# EAGLE schematic Range Finder Schematic v16 (EAGLE 9.7.0)
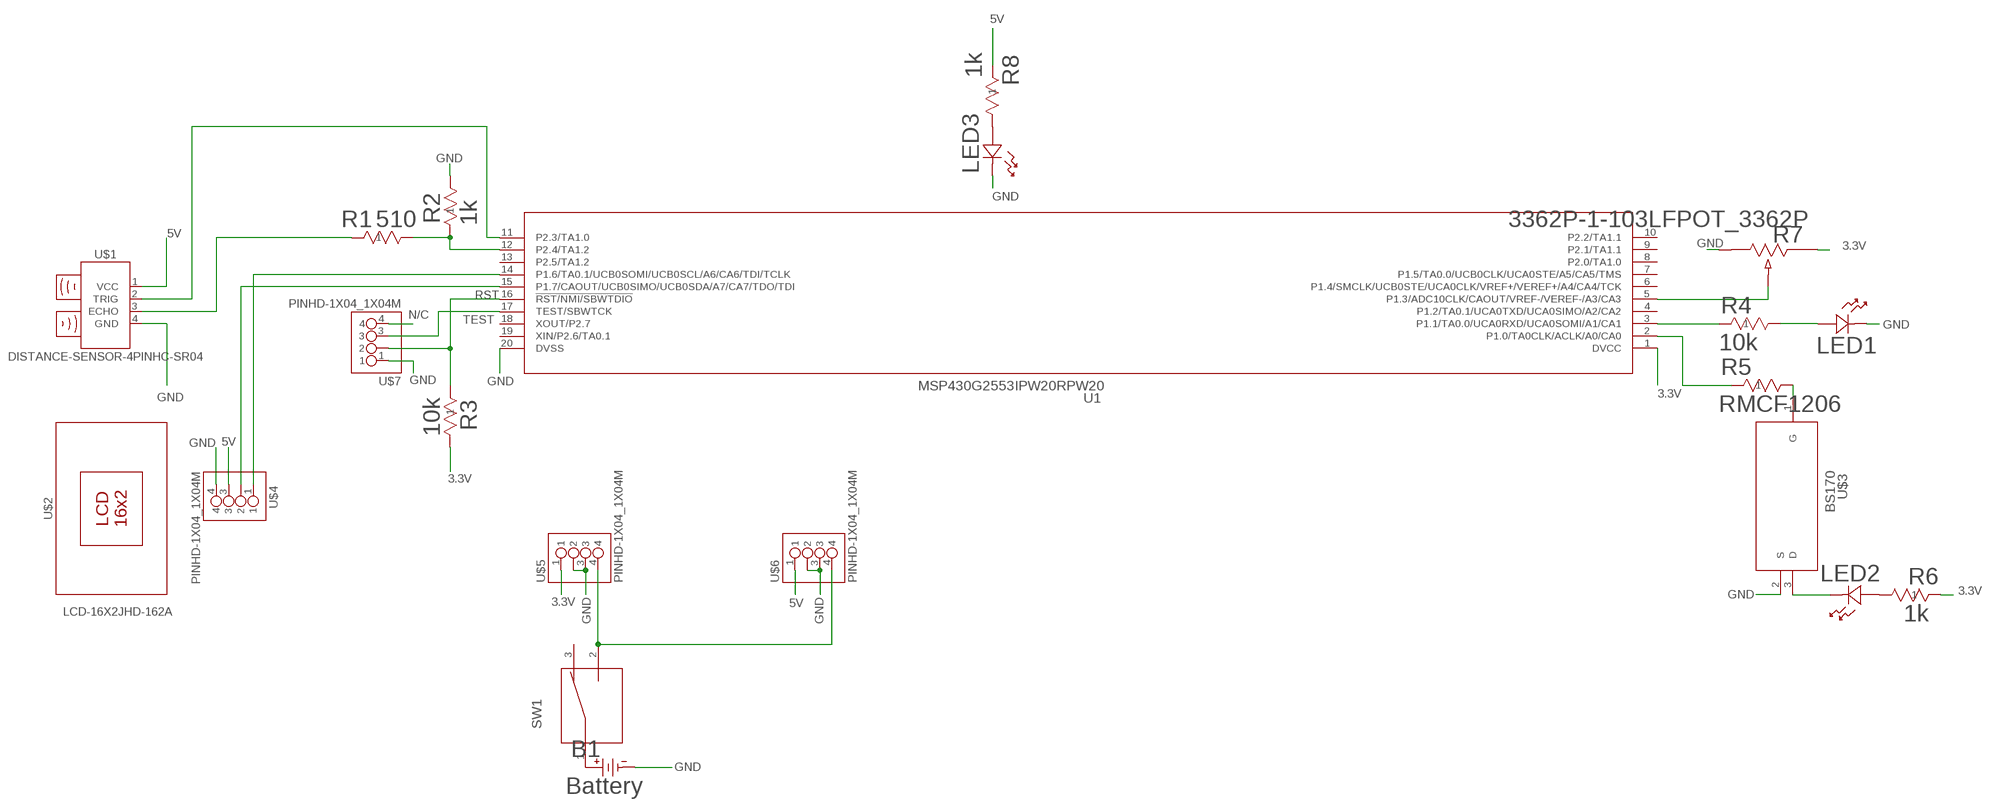
[diagram p0: schematic, sheet 1]

## Parts
B1  Battery  24622462_KEY  [2462_KEY]
LED1  150080BS75000LED_BS75000_WRE  [LED_BS75000_WRE]
LED2  150080BS75000LED_BS75000_WRE  [LED_BS75000_WRE]
LED3  150080BS75000LED_BS75000_WRE  [LED_BS75000_WRE]
R1  510  RMCF1206JT510RSTA_RMCF1206_STP  [STA_RMCF1206_STP]
R2  1k  RMCF1206JT510RSTA_RMCF1206_STP  [STA_RMCF1206_STP]
R3  10k  RMCF1206JT510RSTA_RMCF1206_STP  [STA_RMCF1206_STP]
R4  10k  RMCF1206JT510RSTA_RMCF1206_STP  [STA_RMCF1206_STP]
R5  RMCF1206  RMCF1206JT510RSTA_RMCF1206_STP  [STA_RMCF1206_STP]
R6  1k  RMCF1206JT510RSTA_RMCF1206_STP  [STA_RMCF1206_STP]
R7  3362P-1-103LFPOT_3362P  [POT_3362P]
R8  1k  RMCF1206JT510RSTA_RMCF1206_STP  [STA_RMCF1206_STP]
SW1  09.03201.0209.03201_EAO  [09.03201_EAO]
U1  MSP430G2553IPW20RPW20  [PW20]
U$1  DISTANCE-SENSOR-4PINHC-SR04  [HC-SR04]
U$2  LCD-16X2JHD-162A  [JHD-162A]
U$3  BS170  [SOT-23_DIO]
U$4  PINHD-1X04_1X04M  [1X04]
U$5  PINHD-1X04_1X04M  [1X04]
U$6  PINHD-1X04_1X04M  [1X04]
U$7  PINHD-1X04_1X04M  [1X04]

## Nets
3.3V: R3.2 R6.1 R7.1 U1.1(DVCC) U$5.1
5V: R8.1 U$1.1(VCC) U$4.3 U$6.1
GND: B1.1 LED1.1 LED3.1 R2.2 R7.3 U1.20(DVSS) U$1.4(GND) U$3.2(S) U$4.4 U$5.2 U$5.3 U$6.2 U$6.3 U$7.1
N$1: R1.2 R2.1 U1.12(P2.4/TA1.2)
N$2: R1.1 U$1.3(ECHO)
N$3: U1.11(P2.3/TA1.0) U$1.2(TRIG)
N$4: U1.14(P1.6/TA0.1/UCB0SOMI/UCB0SCL/A6/CA6/TDI/TCLK) U$4.1
N$5: U1.15(P1.7/CAOUT/UCB0SIMO/UCB0SDA/A7/CA7/TDO/TDI) U$4.2
N$6: R4.1 U1.3(P1.1/TA0.0/UCA0RXD/UCA0SOMI/A1/CA1)
N$7: LED1.2 R4.2
N$8: R5.1 U1.2(P1.0/TA0CLK/ACLK/A0/CA0)
N$9: R5.2 U$3.1(G)
N$10: LED2.2 R6.2
N$11: LED2.1 U$3.3(D)
N$12: R7.2 U1.5(P1.3/ADC10CLK/CAOUT/VREF-/VEREF-/A3/CA3)
N$13: B1.2 SW1.1
N$14: LED3.2 R8.2
N$15: SW1.2 U$5.4 U$6.4
N/C: U$7.4
RST: R3.1 U1.16(!RST/NMI/SBWTDIO) U$7.2
TEST: U1.17(TEST/SBWTCK) U$7.3
Unconnected: SW1.3 U1.4(P1.2/TA0.1/UCA0TXD/UCA0SIMO/A2/CA2) U1.6(P1.4/SMCLK/UCB0STE/UCA0CLK/VREF+/VEREF+/A4/CA4/TCK) U1.7(P1.5/TA0.0/UCB0CLK/UCA0STE/A5/CA5/TMS) U1.8(P2.0/TA1.0) U1.9(P2.1/TA1.1) U1.10(P2.2/TA1.1) U1.13(P2.5/TA1.2) U1.18(XOUT/P2.7) U1.19(XIN/P2.6/TA0.1)

## Library data of the parts
B1 = Range_Finder_lib:2462; COPYRIGHT: Copyright (C) 2025 Ultra Librarian. All rights reserved.; MANUFACTURER_PART_NUMBER: 2462; MFR_NAME: Keystone Electronics
LED1-LED3 = Range_Finder_lib:150080BS75000; COPYRIGHT: Copyright (C) 2024 Ultra Librarian. All rights reserved.; MANUFACTURER_PART_NUMBER: 150080BS75000; MFR_NAME: Wurth Electronics
R1-R6 R8 = Range_Finder_lib:RMCF1206JT510R; COPYRIGHT: Copyright (C) 2025 Ultra Librarian. All rights reserved.; MANUFACTURER_PART_NUMBER: RMCF1206JT510R; MFR_NAME: Stackpole International
R7 = Range_Finder_lib:3362P-1-103LF; COPYRIGHT: Copyright (C) 2025 Ultra Librarian. All rights reserved.; MANUFACTURER_PART_NUMBER: 3362P-1-103LF; MFR_NAME: Bourns Electronics
SW1 = Range_Finder_lib:09.03201.02; COPYRIGHT: Copyright (C) 2025 Ultra Librarian. All rights reserved.; MANUFACTURER_PART_NUMBER: 09.03201.02; MFR_NAME: EAO; TYPE: Slide Switches
U1 = Range_Finder_lib:MSP430G2553IPW20R; COPYRIGHT: Copyright (C) 2025 Ultra Librarian. All rights reserved.; MANUFACTURER_PART_NUMBER: MSP430G2553IPW20R; MFR_NAME: Texas Instruments
U$1 = Tinkercad:DISTANCE-SENSOR-4PIN
U$2 = LCD_DISP-6:LCD-16X2
U$3 = Range_Finder_lib:BS170
U$4-U$7 = Library_Reg:PINHD-1X04